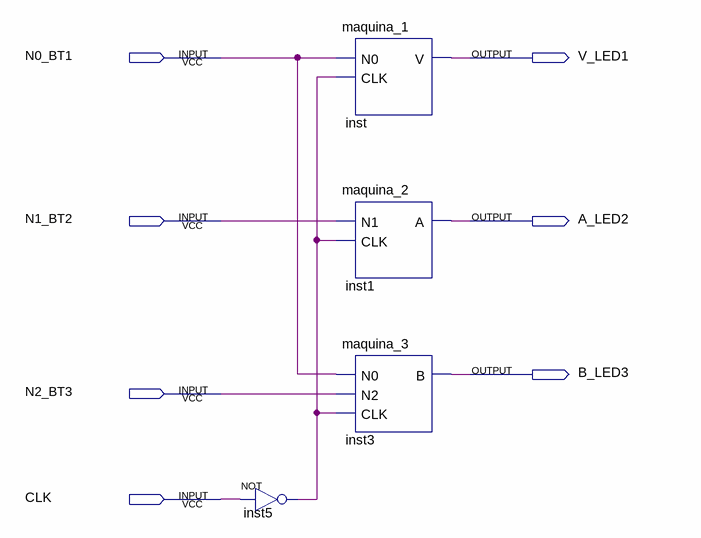
[diagram p0: schematic sheet]
// Quartus schematic projeto.bdf as structural Verilog: 4 symbols, 7 pins
module projeto (
  input  N0_BT1,
  input  N1_BT2,
  input  N2_BT3,
  input  CLK,
  output V_LED1,
  output A_LED2,
  output B_LED3
);

  wire inst5_out;

  not inst5 (inst5_out, CLK);
  maquina_1 inst (.N0(N0_BT1), .CLK(inst5_out), .V(V_LED1));
  maquina_2 inst1 (.N1(N1_BT2), .CLK(inst5_out), .A(A_LED2));
  maquina_3 inst3 (.N0(N0_BT1), .N2(N2_BT3), .CLK(inst5_out), .B(B_LED3));
endmodule
